# Altium schematic sheet ADC.SchDoc
size A4; DocumentNumber: 2; SheetNumber: 2; SheetTotal: 3
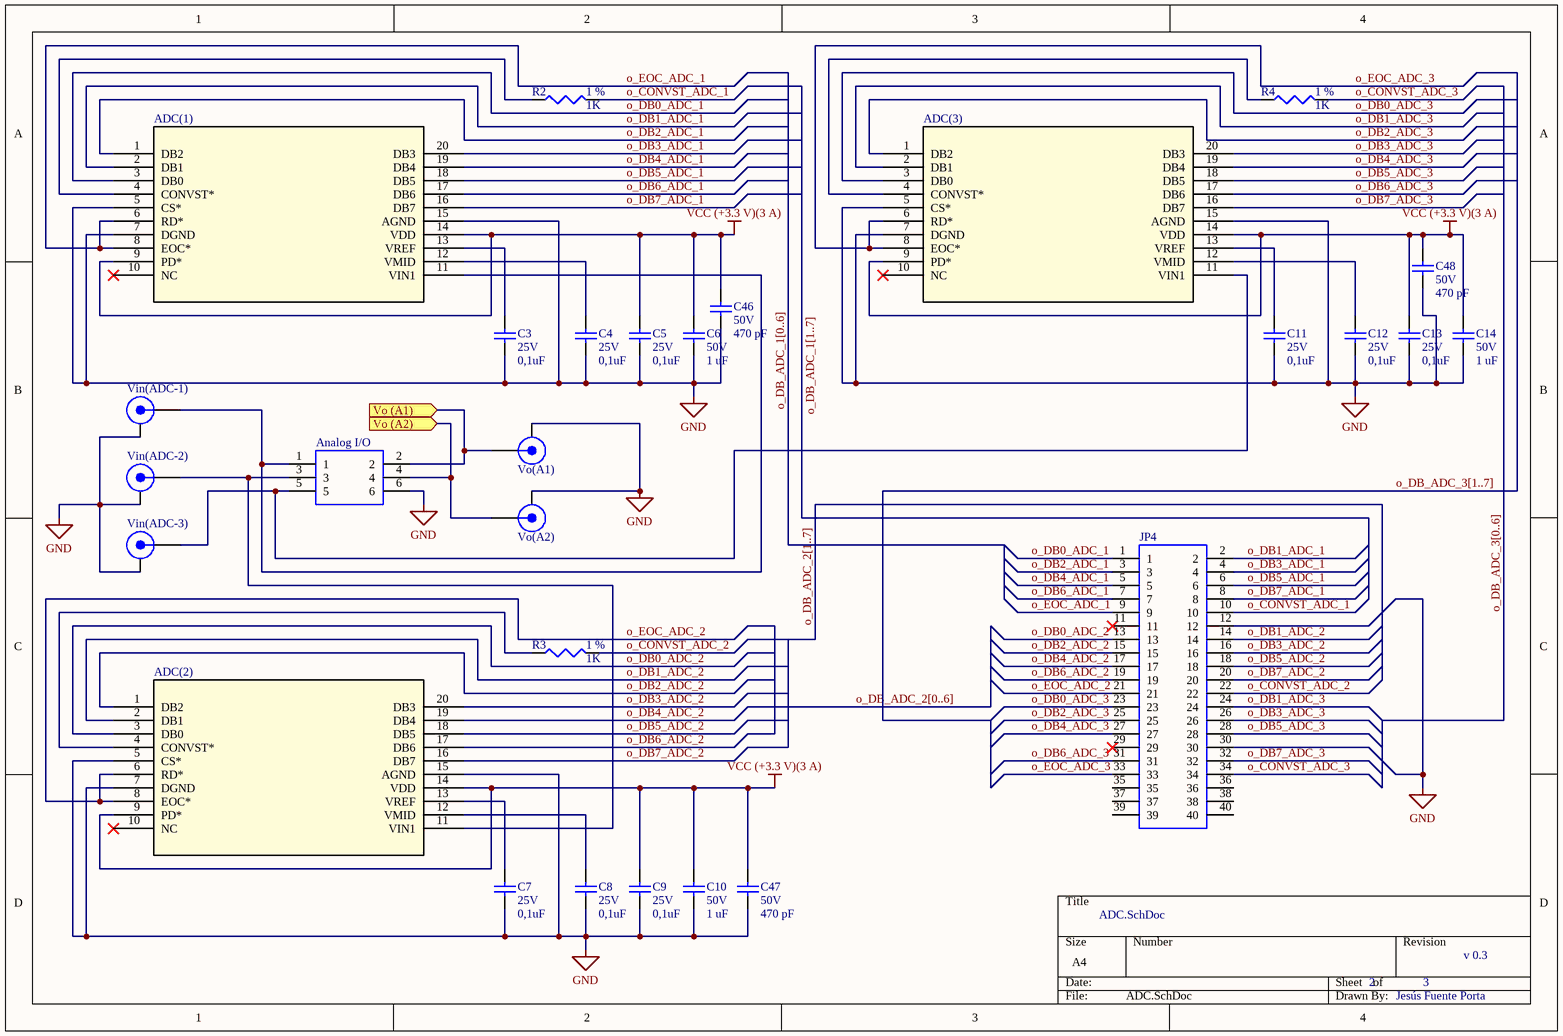
[diagram p0: ADC.SchDoc]

## Parts
ADC(1)  AD7822BR  [RW_20-M (AD7822BR)]  (value not drawn)
ADC(2)  AD7822BR  [RW_20-M (AD7822BR)]  (value not drawn)
ADC(3)  AD7822BR  [RW_20-M (AD7822BR)]  (value not drawn)
Analog_I/O  IDC Connector_6p  [IDC Connector - 6 pins]  (value not drawn)
C3  25V  value 0,1uF  [1206 [Métrica 3216]]
C4  25V  value 0,1uF  [1206 [Métrica 3216]]
C5  25V  value 0,1uF  [1206 [Métrica 3216]]
C6  50V  value 1 uF  [1206 [Métrica 3216]]
C7  25V  value 0,1uF  [1206 [Métrica 3216]]
C8  25V  value 0,1uF  [1206 [Métrica 3216]]
C9  25V  value 0,1uF  [1206 [Métrica 3216]]
C10  50V  value 1 uF  [1206 [Métrica 3216]]
C11  25V  value 0,1uF  [1206 [Métrica 3216]]
C12  25V  value 0,1uF  [1206 [Métrica 3216]]
C13  25V  value 0,1uF  [1206 [Métrica 3216]]
C14  50V  value 1 uF  [1206 [Métrica 3216]]
C46  50V  value 470 pF  [1206 [Métrica 3216]]
C47  50V  value 470 pF  [1206 [Métrica 3216]]
C48  50V  value 470 pF  [1206 [Métrica 3216]]
JP4  IDC Connector_40p  [IDC Connector - 40 pins]  (value not drawn)
R2  1 %  value 1K  [1206 [Métrica 3216]]
R3  1 %  value 1K  [1206 [Métrica 3216]]
R4  1 %  value 1K  [1206 [Métrica 3216]]
Vin(ADC-1)  19S101-40ML5  [ROS-19S101-40ML5_V]  (value not drawn)
Vin(ADC-2)  19S101-40ML5  [ROS-19S101-40ML5_V]  (value not drawn)
Vin(ADC-3)  19S101-40ML5  [ROS-19S101-40ML5_V]  (value not drawn)
Vo(A1)  19S101-40ML5  [ROS-19S101-40ML5_V]  (value not drawn)
Vo(A2)  19S101-40ML5  [ROS-19S101-40ML5_V]  (value not drawn)

## Ports
Vo (A1) (in), Vo (A2) (in)

## Nets
GND: ADC(1).5(CS*) ADC(1).7(DGND) ADC(1).15(AGND) ADC(2).5(CS*) ADC(2).7(DGND) ADC(2).15(AGND) ADC(3).5(CS*) ADC(3).7(DGND) ADC(3).15(AGND) Analog_I/O.6 C3.1 C4.1 C5.1 C6.1 C7.1 C8.1 C9.1 C10.1 C11.1 C12.1 C13.1 C14.1 C46.1 C47.1 C48.1 JP4.12 JP4.30 Vin(ADC-1).MP Vin(ADC-2).MP Vin(ADC-3).MP Vo(A1).MP Vo(A2).MP
VCC (+3.3 V)(3 A): ADC(1).9(PD*) ADC(1).14(VDD) ADC(2).9(PD*) ADC(2).14(VDD) ADC(3).9(PD*) ADC(3).14(VDD) C5.2 C6.2 C9.2 C10.2 C13.2 C14.2 C46.2 C47.2 C48.2
o_CONVST_ADC_1: JP4.10 R2.2
o_CONVST_ADC_2: JP4.22 R3.2
o_CONVST_ADC_3: JP4.34 R4.2
o_DB0_ADC_1: ADC(1).3(DB0) JP4.1
o_DB0_ADC_2: ADC(2).3(DB0) JP4.13
o_DB0_ADC_3: ADC(3).3(DB0) JP4.23
o_DB1_ADC_1: ADC(1).2(DB1) JP4.2
o_DB1_ADC_2: ADC(2).2(DB1) JP4.14
o_DB1_ADC_3: ADC(3).2(DB1) JP4.24
o_DB2_ADC_1: ADC(1).1(DB2) JP4.3
o_DB2_ADC_2: ADC(2).1(DB2) JP4.15
o_DB2_ADC_3: ADC(3).1(DB2) JP4.25
o_DB3_ADC_1: ADC(1).20(DB3) JP4.4
o_DB3_ADC_2: ADC(2).20(DB3) JP4.16
o_DB3_ADC_3: ADC(3).20(DB3) JP4.26
o_DB4_ADC_1: ADC(1).19(DB4) JP4.5
o_DB4_ADC_2: ADC(2).19(DB4) JP4.17
o_DB4_ADC_3: ADC(3).19(DB4) JP4.27
o_DB5_ADC_1: ADC(1).18(DB5) JP4.6
o_DB5_ADC_2: ADC(2).18(DB5) JP4.18
o_DB5_ADC_3: ADC(3).18(DB5) JP4.28
o_DB6_ADC_1: ADC(1).17(DB6) JP4.7
o_DB6_ADC_2: ADC(2).17(DB6) JP4.19
o_DB6_ADC_3: ADC(3).17(DB6) JP4.31
o_DB7_ADC_1: ADC(1).16(DB7) JP4.8
o_DB7_ADC_2: ADC(2).16(DB7) JP4.20
o_DB7_ADC_3: ADC(3).16(DB7) JP4.32
o_EOC_ADC_1: ADC(1).6(RD*) ADC(1).8(EOC*) JP4.9
o_EOC_ADC_2: ADC(2).6(RD*) ADC(2).8(EOC*) JP4.21
o_EOC_ADC_3: ADC(3).6(RD*) ADC(3).8(EOC*) JP4.33
Vo (A1): Analog_I/O.2 Vo(A1).1 ; port Vo (A1)
Vo (A2): Analog_I/O.4 Vo(A2).1 ; port Vo (A2)
NetADC(1)_4: ADC(1).4(CONVST*) R2.1
NetADC(1)_11: ADC(1).11(VIN1) Analog_I/O.1 Vin(ADC-1).1
NetADC(1)_12: ADC(1).12(VMID) C4.2
NetADC(1)_13: ADC(1).13(VREF) C3.2
NetADC(2)_4: ADC(2).4(CONVST*) R3.1
NetADC(2)_11: ADC(2).11(VIN1) Analog_I/O.3 Vin(ADC-2).1
NetADC(2)_12: ADC(2).12(VMID) C8.2
NetADC(2)_13: ADC(2).13(VREF) C7.2
NetADC(3)_4: ADC(3).4(CONVST*) R4.1
NetADC(3)_11: ADC(3).11(VIN1) Analog_I/O.5 Vin(ADC-3).1
NetADC(3)_12: ADC(3).12(VMID) C12.2
NetADC(3)_13: ADC(3).13(VREF) C11.2

Not connected (* = marked no-connect by the designer): ADC(1) 10(NC)*; ADC(2) 10(NC)*; ADC(3) 10(NC)*; JP4 11* 29* 35 36 37 38 39 40

## Buses and harness runs
bus o_DB_ADC_1[0..6]
bus o_DB_ADC_1[1..7]
bus o_DB_ADC_2[0..6]
bus o_DB_ADC_2[1..7]
bus o_DB_ADC_3[0..6]
bus o_DB_ADC_3[1..7]

## Notes on the sheet
- (near Analog_I/O) IDC connector for Analog Inputs for each ADC.
- (near JP4) IDC connector for Digital Input&Output ADC signals.
- v 0.3
- Jesús Fuente Porta

## Library data of the parts
ADC(1) ADC(2) ADC(3) = AD7822BR: 1-Channel Single ADC Semiflash 2Msps 8-bit Parallel 20-Pin SOIC W Tube; Vendor: Analog Devices Inc; Built_By: EMA_UL_Team; C: Copyright (C) 2015 Accelerated Designs. All rights reserved; Manufacturer_Part_Number: AD7822BR; RefDes: RefDes; Type: DEV; Value: Value; ComponentLink1Description: Arrow Webpage; ComponentLink1URL: https://www.arrow.com/es-mx/products/ad7822br/analog-devices; ComponentLink2Description: RS webpage (Different Footprint but equivalent functionality); ComponentLink2URL: https://es.rs-online.com/web/p/convertidores-analogico-a-digital-para-uso-general/5384656/
Analog_I/O = IDC Connector_6p: MC-254-06-00-ST-DIP -  Conector de Cable a Placa, 2.54 mm, 6 Contactos, Header, Agujero Pasante, 2 Filas; Manufacturer_Name: RS Components; Manufacturer_Part_Number: 6257296; Geometry.Height: 8.9mm; RS Part Number: 6257296; Datasheet Link: https://componentsearchengine.com/Datasheets/3/6257296.pdf; ComponentLink1Description: Farnell Webpage; ComponentLink1URL: https://es.farnell.com/multicomp/mc-254-06-00-st-dip/conector-macho-6pos-2fila-2-54mm/dp/2843525?ost=MC-254-06-00-ST-DIP&ddkey=https%3Aes-ES%2FElement14_Spain%2Fsearch
C3-C5 C7-C9 C11-C13 = Cap Semi: VJ1206Y104KXXCW1BC -  Condensador de Cerámica Multicapa, 0.1 µF, 25 V, 1206 [Métrica 3216], ± 10%, X7R, VJ Series; Published: 8-Jun-2000; LatestRevisionDate: 29-May-2009; LatestRevisionNote: IPC-7351 Footprint Added.; PackageReference: C1206; Publisher: Altium Limited; PackageDescription: Chip Capacitor; ComponentLink1Description: Farnell; ComponentLink1URL: https://es.farnell.com/vishay/vj1206y104kxxcw1bc/conden-0-1-f-25v-10-x7r-1206/dp/2896645
C6 C10 C14 = Cap Semi: MC1206B105K500CT -  Condensador de Cerámica Multicapa, 1 µF, 50 V, 1206 [Métrica 3216], ± 10%, X7R, Serie MC; Published: 8-Jun-2000; LatestRevisionDate: 29-May-2009; LatestRevisionNote: IPC-7351 Footprint Added.; PackageReference: C1206; Publisher: Altium Limited; PackageDescription: Chip Capacitor; ComponentLink1Description: Farnell Webpage; ComponentLink1URL: https://es.farnell.com/multicomp/mcsh31b105k500ct/conden-1-f-50v-10-x7r-1206/dp/1856643
C46-C48 = Cap Semi: VJ1206A471JXACW1BC -  Condensador de Cerámica Multicapa, 470 pF, 50 V, 1206 [Métrica 3216], ± 5%, C0G / NP0, VJ Series; Published: 8-Jun-2000; LatestRevisionDate: 29-May-2009; LatestRevisionNote: IPC-7351 Footprint Added.; PackageReference: C1206; Publisher: Altium Limited; PackageDescription: Chip Capacitor; ComponentLink1Description: Farnell; ComponentLink1URL: https://es.farnell.com/vishay/vj1206a471jxacw1bc/conden-470pf-50v-5-c0g-np0-1206/dp/2896616
JP4 = IDC Connector_40p: MC-254-40-00-ST-DIP -  Conector de Cable a Placa, 2.54 mm, 40 Contactos, Header, Agujero Pasante, 2 Filas; Manufacturer_Name: RS Components; Manufacturer_Part_Number: 6257296; Geometry.Height: 8.9mm; RS Part Number: 6257296; Datasheet Link: https://componentsearchengine.com/Datasheets/3/6257296.pdf; ComponentLink1Description: Farnell Webpage; ComponentLink1URL: https://es.farnell.com/multicomp/mc-254-40-00-st-dip/conector-macho-40pos-2fila-2-54mm/dp/2843536
R2-R4 = Res3: MCWR12X1001FTL -  Resistencia SMD de Tipo Chip, Película Gruesa, 1206 [Métrica 3216], 1 kohm, Serie MCWR, 200 V; Published: 8-Jun-2000; LatestRevisionDate: 29-May-2009; LatestRevisionNote: IPC-7351 Footprint Added.; PackageReference: J1-0603; Publisher: Altium Limited; PackageDescription: Chip Resistor; ComponentLink1Description: Farnell Webpage; ComponentLink1URL: https://es.farnell.com/multicomp/mcwr12x1001ftl/res-1k-1-0-25w-1206-pel-c-gruesa/dp/2447473
Vin(ADC-1) Vin(ADC-2) Vin(ADC-3) Vo(A1) Vo(A2) = 19S101-40ML5: 85305-0232 -  Conector de RF / Coaxial, Coaxial SMP, Macho Recto, Montaje Superficial Vertical, 50 ohm, Latón; Detention force: limited detent; Lock-in Range: small; Design Note: Footprint in library is a generic example - only application specific footprint delivers High Performance; DatasheetVersion: a00; PackageVersion: a00; PackageReference: 19S101-40ML5; PackageDescription: SMP Straight Plug Limited Detent, Small, 6 x 5 x 4.1 mm; Mounting Technology: Surface Mount; PartNumber: 19S101-40ML5; ComponentLink1Description: Farnell Webpage; ComponentLink1URL: https://es.farnell.com/molex/85305-0232/coax-rf-smp-macho-50-ohm-pcb/dp/2396235; ComponentLink2Description: Datasheet; ComponentLink2URL: http://rosenberger.de/ok/images/documents/db/19S101-40ML5.pdf; ComponentLink3Description: Package Specification; ComponentLink3URL: http://rosenberger.de/ok/images/documents/db/19S101-40ML5.pdf; ComponentLink4Description: Series Overview / Design Note; ComponentLink4URL: http://rosenberger.de/ok/images/documents/spez/19.pdf; ComponentLink5Description: Webshop / RFQ; ComponentLink5URL: http://www.rosenberger.com/en/contact/sales/